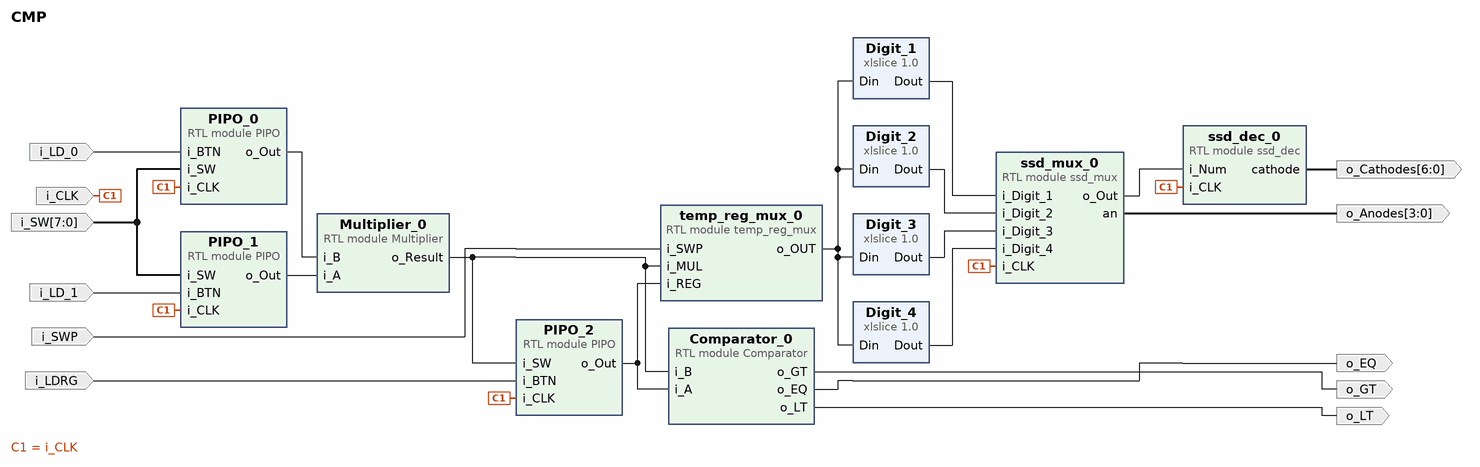
[diagram p0: block diagram of the top level]
# Vivado block design CMP, xc7z007sclg400-1, Vivado 2018.2
create_bd_design CMP

create_bd_port -dir I -type clk i_CLK
set_property -dict {CONFIG.FREQ_HZ 100000000} [get_bd_ports i_CLK]
create_bd_port -dir I i_LD_0
create_bd_port -dir I i_LD_1
create_bd_port -dir I -from 7 -to 0 i_SW
create_bd_port -dir I i_LDRG
create_bd_port -dir O o_GT
create_bd_port -dir O o_EQ
create_bd_port -dir O o_LT
create_bd_port -dir O -from 6 -to 0 o_Cathodes
create_bd_port -dir O -from 3 -to 0 o_Anodes
create_bd_port -dir I i_SWP

create_bd_cell -type module -reference Multiplier Multiplier_0
create_bd_cell -type module -reference PIPO PIPO_0
create_bd_cell -type module -reference PIPO PIPO_1
create_bd_cell -type module -reference PIPO PIPO_2
set_property -dict {CONFIG.BUS_MSB 15} [get_bd_cells PIPO_2]
create_bd_cell -type module -reference Comparator Comparator_0
create_bd_cell -type ip -vlnv xilinx.com:ip:xlslice:1.0 Digit_1
set_property -dict {CONFIG.DIN_TO 12 CONFIG.DIN_FROM 15 CONFIG.DIN_WIDTH 16 CONFIG.DOUT_WIDTH 4} [get_bd_cells Digit_1]
create_bd_cell -type ip -vlnv xilinx.com:ip:xlslice:1.0 Digit_2
set_property -dict {CONFIG.DIN_TO 8 CONFIG.DIN_FROM 11 CONFIG.DIN_WIDTH 16 CONFIG.DOUT_WIDTH 4} [get_bd_cells Digit_2]
create_bd_cell -type ip -vlnv xilinx.com:ip:xlslice:1.0 Digit_3
set_property -dict {CONFIG.DIN_TO 4 CONFIG.DIN_FROM 7 CONFIG.DIN_WIDTH 16 CONFIG.DOUT_WIDTH 4} [get_bd_cells Digit_3]
create_bd_cell -type ip -vlnv xilinx.com:ip:xlslice:1.0 Digit_4
set_property -dict {CONFIG.DIN_TO 0 CONFIG.DIN_FROM 3 CONFIG.DIN_WIDTH 16 CONFIG.DOUT_WIDTH 4} [get_bd_cells Digit_4]
create_bd_cell -type module -reference ssd_dec ssd_dec_0
create_bd_cell -type module -reference ssd_mux ssd_mux_0
create_bd_cell -type module -reference temp_reg_mux temp_reg_mux_0

# ---- connections ----

connect_bd_net [get_bd_pins PIPO_0/o_Out] [get_bd_pins Multiplier_0/i_B]
connect_bd_net [get_bd_pins PIPO_1/o_Out] [get_bd_pins Multiplier_0/i_A]
connect_bd_net -net clk_100MHz_1 [get_bd_ports i_CLK] \
  [get_bd_pins PIPO_0/i_CLK] [get_bd_pins PIPO_1/i_CLK] [get_bd_pins ssd_dec_0/i_CLK] [get_bd_pins ssd_mux_0/i_CLK] \
  [get_bd_pins PIPO_2/i_CLK]
connect_bd_net -net i_A_0_1 [get_bd_ports i_SW] [get_bd_pins PIPO_0/i_SW] [get_bd_pins PIPO_1/i_SW]
connect_bd_net -net i_BTN_0_1 [get_bd_ports i_LD_1] [get_bd_pins PIPO_1/i_BTN]
connect_bd_net -net i_BTN_1_1 [get_bd_ports i_LD_0] [get_bd_pins PIPO_0/i_BTN]
connect_bd_net [get_bd_pins PIPO_2/o_Out] [get_bd_pins Comparator_0/i_A] [get_bd_pins temp_reg_mux_0/i_REG]
connect_bd_net [get_bd_pins Comparator_0/o_GT] [get_bd_ports o_GT]
connect_bd_net [get_bd_pins Comparator_0/o_EQ] [get_bd_ports o_EQ]
connect_bd_net [get_bd_pins Comparator_0/o_LT] [get_bd_ports o_LT]
connect_bd_net [get_bd_pins Digit_1/Dout] [get_bd_pins ssd_mux_0/i_Digit_1]
connect_bd_net [get_bd_pins Digit_2/Dout] [get_bd_pins ssd_mux_0/i_Digit_2]
connect_bd_net [get_bd_pins Digit_3/Dout] [get_bd_pins ssd_mux_0/i_Digit_3]
connect_bd_net [get_bd_pins Digit_4/Dout] [get_bd_pins ssd_mux_0/i_Digit_4]
connect_bd_net [get_bd_pins ssd_mux_0/o_Out] [get_bd_pins ssd_dec_0/i_Num]
connect_bd_net [get_bd_pins ssd_dec_0/cathode] [get_bd_ports o_Cathodes]
connect_bd_net [get_bd_pins ssd_mux_0/an] [get_bd_ports o_Anodes]
connect_bd_net -net i_SWP_0_1 [get_bd_ports i_SWP] [get_bd_pins temp_reg_mux_0/i_SWP]
connect_bd_net [get_bd_pins Multiplier_0/o_Result] [get_bd_pins temp_reg_mux_0/i_MUL] [get_bd_pins PIPO_2/i_SW] [get_bd_pins Comparator_0/i_B]
connect_bd_net [get_bd_ports i_LDRG] [get_bd_pins PIPO_2/i_BTN]
connect_bd_net [get_bd_pins temp_reg_mux_0/o_OUT] \
  [get_bd_pins Digit_4/Din] [get_bd_pins Digit_3/Din] [get_bd_pins Digit_2/Din] [get_bd_pins Digit_1/Din]

validate_bd_design
save_bd_design
